# Altium schematic sheet 1V2-BUCK.SchDoc
size A2; SheetNumber: 5; SheetTotal: 17
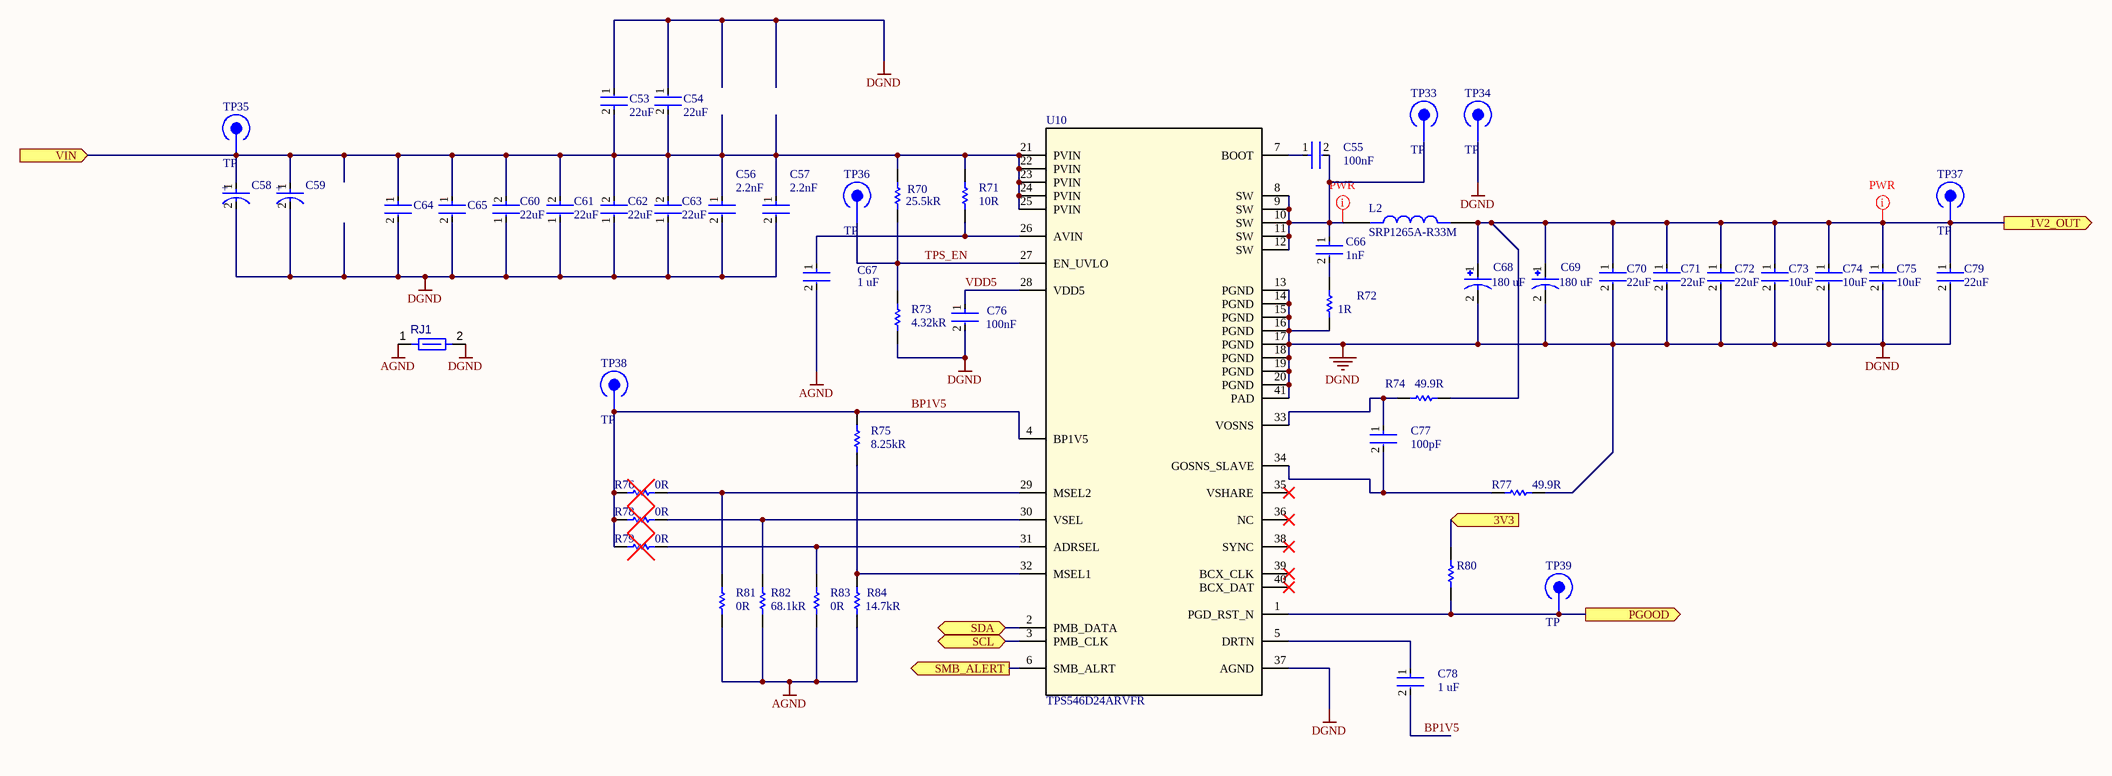
[diagram p0: 1V2-BUCK.SchDoc]

## Parts
C53  Capacitance: 22uF  [FP-GRM31C-0_3-e0_3_0_8-MFG]  (hidden comment: GRM31CC81E226ME11L)
C54  Capacitance: 22uF  [FP-GRM31C-0_3-e0_3_0_8-MFG]  (hidden comment: GRM31CC81E226ME11L)
C55  value 100nF  [FP-CC0402-IPC_B]  (hidden comment: CC0402KRX7R9BB104)
C56  value 2.2nF  [FP-CC0402-MFG]  (hidden comment: CC0402KRX7R8BB222)
C57  value 2.2nF  [FP-CC0402-MFG]  (hidden comment: CC0402KRX7R8BB222)
C58  593D107X9020E2TE3  [593D107X9020E2TE3-Footprint-1]  (value not drawn)
C59  593D107X9020E2TE3  [593D107X9020E2TE3-Footprint-1]  (value not drawn)
C60  Capacitance: 22uF  [FP-GRM31C-0_3-e0_3_0_8-MFG]  (hidden comment: GRM31CC81E226ME11L)
C61  Capacitance: 22uF  [FP-GRM31C-0_3-e0_3_0_8-MFG]  (hidden comment: GRM31CC81E226ME11L)
C62  Capacitance: 22uF  [FP-GRM31C-0_3-e0_3_0_8-MFG]  (hidden comment: GRM31CC81E226ME11L)
C63  Capacitance: 22uF  [FP-GRM31C-0_3-e0_3_0_8-MFG]  (hidden comment: GRM31CC81E226ME11L)
C64  C3216X5R1E476M160AC  [FP-C3216-160-0_2-MFG]  (value not drawn)
C65  C3216X5R1E476M160AC  [FP-C3216-160-0_2-MFG]  (value not drawn)
C66  value 1nF  [FP-CC0805-0_85-MFG]  (hidden comment: CC0805KRX7R9BB102)
C67  value 1 uF  [FP-CC0402-MFG]  (hidden comment: CC0402KRX5R6BB105)
C68  value 180 uF  [EEF-SX0J181ER-Footprint-1]  (hidden comment: EEF-SX0J181ER)
C69  value 180 uF  [EEF-SX0J181ER-Footprint-1]  (hidden comment: EEF-SX0J181ER)
C70  value 22uF  [FP-GRM21B-0_2-e0_2_0_7-MFG]  (hidden comment: GRM21BZ70J226ME44L)
C71  value 22uF  [FP-GRM21B-0_2-e0_2_0_7-MFG]  (hidden comment: GRM21BZ70J226ME44L)
C72  value 22uF  [FP-GRM21B-0_2-e0_2_0_7-MFG]  (hidden comment: GRM21BZ70J226ME44L)
C73  value 10uF  [FP-GRM21B-0_15-MFG]  (hidden comment: GRM21BR71A106KA73L)
C74  value 10uF  [FP-GRM21B-0_15-MFG]  (hidden comment: GRM21BR71A106KA73L)
C75  value 10uF  [FP-GRM21B-0_15-MFG]  (hidden comment: GRM21BR71A106KA73L)
C76  value 100nF  [FP-CC0402-IPC_B]  (hidden comment: CC0402KRX7R9BB104)
C77  value 100pF  [FP-CC0402-MFG]  (hidden comment: CC0402KRX7R9BB101)
C78  value 1 uF  [FP-CC0402-MFG]  (hidden comment: CC0402KRX5R6BB105)
C79  value 22uF  [FP-GRM21B-0_2-e0_2_0_7-MFG]  (hidden comment: GRM21BZ70J226ME44L)
L2  SRP1265A-R33M  [SRP1265A-R33M]
R70  value 25.5kR  [RESC1005X40X25LL10T10]  (hidden comment: RK73H1ETTP2552F)
R71  value 10R  [RESC1005X40X25LL10T10]  (hidden comment: RK73H1ETTP10R0F)
R72  value 1R  [FP-RK73H2E-MFG]  (hidden comment: RK73H2ETTD1R00F)
R73  value 4.32kR  [RESC1005X40X25ML10T10]  (hidden comment: RK73H1ETTP4321F)
R74  value 49.9R  [RESC1005X40X25LL10T10]  (hidden comment: RK73H1ETTP49R9F)
R75  value 8.25kR  [RESC1005X40X25NL10T10]  (hidden comment: RK73H1ETTP8251F)
R76  value 0R  [FP-RK73Z1E-IPC_B]  (hidden comment: RK73Z1ETTP)  (no BOM)
R77  value 49.9R  [RESC1005X40X25LL10T10]  (hidden comment: RK73H1ETTP49R9F)
R78  value 0R  [FP-RK73Z1E-IPC_B]  (hidden comment: RK73Z1ETTP)  (no BOM)
R79  value 0R  [FP-RK73Z1E-IPC_B]  (hidden comment: RK73Z1ETTP)  (no BOM)
R80  RK73H1ETTP1002F  [RESC1005X40X25LL10T10]  (value not drawn)
R81  value 0R  [FP-RK73Z1E-IPC_B]  (hidden comment: RK73Z1ETTP)
R82  value 68.1kR  [RESC1005X40X25LL10T10]  (hidden comment: RK73H1ETTP6812F)
R83  value 0R  [FP-RK73Z1E-IPC_B]  (hidden comment: RK73Z1ETTP)  (no BOM)
R84  value 14.7kR  [RESC1005X40X25LL10T10]  (hidden comment: RK73H1ETTP1472F)
RJ1  Net Tie 12x8mil  [SHORT06-FP]  (value not drawn)  (net tie, no BOM)
TP33  TP  [TP-Footprint-1]
TP34  TP  [TP-Footprint-1]
TP35  TP  [TP-Footprint-1]
TP36  TP  [TP-Footprint-1]
TP37  TP  [TP-Footprint-1]
TP38  TP  [TP-Footprint-1]
TP39  TP  [TP-Footprint-1]
U10  TPS546D24ARVFR  [TPS546D24ARVFR-Footprint-1]

## Ports
1V2_OUT (out), 3V3 (in), PGOOD (out), SCL (bidir), SDA (bidir), SMB_ALERT (out), VIN (in)

## Nets
AGND: C67.2 R81.1 R82.1 R83.1 R84.1 RJ1.1
DGND: C53.1 C54.1 C56.2 C57.2 C58.2(C) C59.2(C) C60.1 C61.1 C62.1 C63.1 C64.2 C65.2 C68.2 C69.2 C70.2 C71.2 C72.2 C73.2 C74.2 C75.2 C76.2 C79.2 R72.1 R73.1 R77.2 RJ1.2 TP34.1 U10.13(PGND) U10.14(PGND) U10.15(PGND) U10.16(PGND) U10.17(PGND) U10.18(PGND) U10.19(PGND) U10.20(PGND) U10.37(AGND) U10.41(PAD)
1V2_OUT: C68.1 C69.1 C70.1 C71.1 C72.1 C73.1 C74.1 C75.1 C79.1 L2.2 R74.2 TP37.1 ; port 1V2_OUT
3V3: R80.2 ; port 3V3
BP1V5: C78.2 R75.1 R76.2 R78.2 R79.2 TP38.1 U10.4(BP1V5)
PGOOD: R80.1 TP39.1 U10.1(PGD_RST_N) ; port PGOOD
SCL: U10.3(PMB_CLK) ; port SCL
SDA: U10.2(PMB_DATA) ; port SDA
SMB_ALERT: U10.6(SMB_ALRT) ; port SMB_ALERT
TPS_EN: R70.1 R73.2 TP36.1 U10.27(EN_UVLO)
VDD5: C76.1 U10.28(VDD5)
VIN: C53.2 C54.2 C56.1 C57.1 C58.1(A) C59.1(A) C60.2 C61.2 C62.2 C63.2 C64.1 C65.1 R70.2 R71.2 TP35.1 U10.21(PVIN) U10.22(PVIN) U10.23(PVIN) U10.24(PVIN) U10.25(PVIN) ; port VIN
NetC55_1: C55.1 U10.7(BOOT)
NetC55_2: C55.2 C66.1 L2.1 TP33.1 U10.8(SW) U10.9(SW) U10.10(SW) U10.11(SW) U10.12(SW)
NetC66_2: C66.2 R72.2
NetC67_1: C67.1 R71.1 U10.26(AVIN)
NetC77_1: C77.1 R74.1 U10.33(VOSNS)
NetC77_2: C77.2 R77.1 U10.34(GOSNS_SLAVE)
NetC78_1: C78.1 U10.5(DRTN)
NetR75_2: R75.2 R84.2 U10.32(MSEL1)
NetR76_1: R76.1 R81.2 U10.29(MSEL2)
NetR78_1: R78.1 R82.2 U10.30(VSEL)
NetR79_1: R79.1 R83.2 U10.31(ADRSEL)

Not connected (* = marked no-connect by the designer): U10 35(VSHARE)* 36(NC)* 38(SYNC)* 39(BCX_CLK)* 40(BCX_DAT)*

## Layout directives
net class PWR: 1V2_OUT, NetC55_2

## Notes on the sheet
- (in symbol CMP-001-00321-3) +

## Library data of the parts
C53 C54 C60-C63 = CMP-06035-043516-1: Chip Multilayer Ceramic Capacitors for General Purpose, 1206, 22uF, X6S, 22%, 20%, 25V; Width: 1.6mm; Dielectric: X6S; Thickness: 1.6mm; Length: 3.2mm; Voltage Rating (DC): 25V; Tolerance: 20%
C55 C76 = CMP-x00152-1: Ceramic Capacitor, Multilayer, Ceramic, 50V, 10% +Tol, 10% -Tol, X7R, 15% TC, 0.1uF, Surface Mount, 0402
C56 C57 = CMP-x00156-1: Ceramic Capacitor, Multilayer, Ceramic, 25V, 10% +Tol, 10% -Tol, X7R, 15% TC, 0.0022uF, Surface Mount, 0402
C58 C59 = CMP-001-00321-3: No Description Available; Mfr_Name: Vishay; Pins: 2; Design Item ID: 593D107X9020E2TE3; Source: 593D107X9020E2TE3.SchLib; Component Type: Standard
C64 C65 = CMP-2000-05397-3: Multilayer Ceramic Capacitors 47uF ±20% 25V X5R SMD 1206; Weight: 0.000571oz; Dielectric: X5R; Length: 0.126inch; Voltage Rating: 25V; Case/Package: 1206; Dielectric Material: Ceramic; Min Operating Temperature: -55°C; Lead Free: Lead Free; Packaging: Tape and Reel; Package Quantity: 1; Mount: Surface Mount; Depth: 1.6mm; REACH SVHC: No SVHC; Termination: SMD/SMT; Case Code (Imperial): 1206; Series: C; Resistor Type: Ceramic; Voltage: 25V; Width: 0.063inch; Height: 1.6mm; Tolerance: 20%; Capacitance: 47uF; Max Operating Temperature: 85°C; Voltage Rating (DC): 25V; RoHS Compliant: Yes; Thickness: 0.071inch; Case Code (Metric): 3216
C66 = CMP-x00143-1: Ceramic Capacitor, Multilayer, Ceramic, 50V, 10% +Tol, 10% -Tol, X7R, 15% TC, 0.001uF, Surface Mount, 0805; Category: Capacitor
C67 C78 = CMP-03422-000489-1: CAP CER 1UF 10V X5R 0402; Manufacturer: YAGEO; Temperature Coefficient: 30ppm/°C; Tolerance: 0.1; Automotive Grade: NA; Material: Ceramic; Device Class L1: Passive Components; Ipc Land Pattern Name: CAPC10050X50; Height: 0.55mm; Voltage Rating: 10 V; Digikey Description: CAP CER 1UF 10V X5R 0402; RoHS: TRUE; Temperature: -55°C to +125°C; Octopart: https://octopart.com/cc0402krx5r6bb105-yageo-42244620; Mouser Description: Multilayer Ceramic Capacitors MLCC - SMD/SMT 1uF 10V X5R 10%; Manufacturer Part Number: CC0402KRX5R6BB105; Temperature Characteristic: X5R; Category: Cap; Automotive: No; Temperature Range Low: -55°C; ComponentLink2Description: Datasheet; Temperature Range High: +125°C; Package: CC0402; Capacitance: 1 uF; Footprint Url: http://www.yageo.com/exep/pages/download/literatures/UPY-C_GEN_24.pdf; ComponentLink2URL: http://www.yageo.com/documents/recent/UPY-GP_NP0_16V-to-50V_16.pdf; Lead Free: Yes; Device Class L3: Ceramic Capacitors; Device Class L2: Capacitors
C68 C69 = CMP-x00146-3: Cap Aluminum Polymer 180uF 6.3VDC 20%( 7.3 X 4.3 X 1.9mm) SMD 0.009 Ohm 6300mA 2000h 105C T/R; Manufacturer: Panasonic; Vendor: TTI; Template: PS_SMD2_C; Reel Width: 12mm; MOQ: 3500; Category: Capacitor; Price: 0.531; Package: SMD-2; Mounting: SMD
C70-C72 C79 = CMP-x00148-1: Ceramic Capacitor, Multilayer, Ceramic, 6.3V, 20% +Tol, 20% -Tol, X7R, 15% TC, 22uF, Surface Mount, 0805
C73-C75 = CMP-x00157-1: Ceramic Capacitor, Multilayer, Ceramic, 10V, 10% +Tol, 10% -Tol, X7R, 15% TC, 10uF, Surface Mount, 0805
C77 = CMP-x00153-1: Ceramic Capacitor, Multilayer, Ceramic, 50V, 10% +Tol, 10% -Tol, X7R, 15% TC, 0.0001uF, Surface Mount, 0402
L2 = CMP-00047-01-A-1: General Purpose Inductor, 0.33uH, 20%, 1 Element, Carbonyl Powder-Core, SMD, 5349; Quality Factor-Min (at L-nom): 10; Package Length: 13.5mm; Channels: 1; Package Height: 6.2mm; Shape/Size Description: RECTANGULAR PACKAGE; Reference Standard: AEC-Q200; DC Resistance (DCR): 0.8mR; Inductor Application: POWER INDUCTOR; Max Current Rating: 46A; Case/Size Code: 5349; Shielding: Shielded; Package Width: 12.5mm; Self Resonant Frequency: 90MHz; Test Frequency: 100kHz; Core Material: Carbonyl Powder; Construction: Shielded; Surface Mount: Yes; RoHS Compliant: Yes; Reach SVHC Compliant: Yes; Inductor Type: GENERAL PURPOSE INDUCTOR; Max Operating Temperature: 150°C; Package Style: SMTMeter; Packaging: Tape and Reel; Pins: 2; Min Operating Temperature: -40°C; Inductance-Nom (L): 0.33uH; Termination: Wraparound; Terminal Placement: Dual Ended; Tolerance: 20%
R70 = CMP-x00151-1: BOM UPDATE 25.5K (NEW) RESISTOR FROM 11.7K (OLD) / NEW: RK73H1ETTP2552F
R71 = CMP-x00144-1: Fixed Resistor, Metal Glaze/thick Film, 0.1W, 10ohm, 75V, 1% +/-Tol, 100ppm/Cel, Surface Mount, 0402
R72 = CMP-x00142-1: Fixed Resistor, Metal Glaze/thick Film, 0.5W, 1ohm, 200V, 1% +/-Tol, 200ppm/Cel, Surface Mount, 1210; Manufacturer: KOA Speer; Template: KO_0402; Reel Width: 8mm; Vendor: TTI; Price: 0.03; MOQ: 5000; Category: Resistor; Mounting: SMT; Package: 1210
R73 = CMP-2002-04015-1: BOM UPDATE 4.32K (NEW) RESISTOR FROM 37.4K (OLD) / NEW: RK73H1ETTP4321F; Manufacturer: KOA Speer; Part Number: RK73H1ETTP3741F
R74 R77 = CMP-x00154-1: Fixed Resistor, Metal Glaze/thick Film, 0.1W, 49.9ohm, 75V, 1% +/-Tol, 100ppm/Cel, Surface Mount, 0402
R75 = CMP-2002-04539-1: Manufacturer: KOA Speer; Part Number: RK73H1ETTP8251F
R76 R78 R79 R81 R83 = CMP-x00147-1: Metal Glaze/thick Film, 0ohm, Surface Mount, 0402
R80 = CMP-x00150-1: Fixed Resistor, Metal Glaze/thick Film, 0.1W, 10000ohm, 75V, 1% +/-Tol, 100ppm/Cel, Surface Mount, 0402; Value: 10kR
R82 = CMP-x00145-1: Fixed Resistor, Metal Glaze/thick Film, 0.1W, 68100ohm, 75V, 1% +/-Tol, 100ppm/Cel, Surface Mount, 0402
R84 = CMP-x00149-1: Fixed Resistor, Metal Glaze/thick Film, 0.1W, 14700ohm, 75V, 1% +/-Tol, 100ppm/Cel, Surface Mount, 0402; Category: Resistor
RJ1 = CMP-009-00121-2: Max Operating Temperature: 155°C; Pins: 2; Min Operating Temperature: -55°C
TP33-TP39 = CMP-001-0086-3: digital shovel test point
U10 = CMP-x00141-6: Switching Regulator, Current-mode, 40A, 1500kHz Switching Freq-Max, PQCC40